# Altium schematic sheet STM32H743_Breakout_V2_TOP.SchDoc
size A4; SheetNumber: 1; SheetTotal: 3
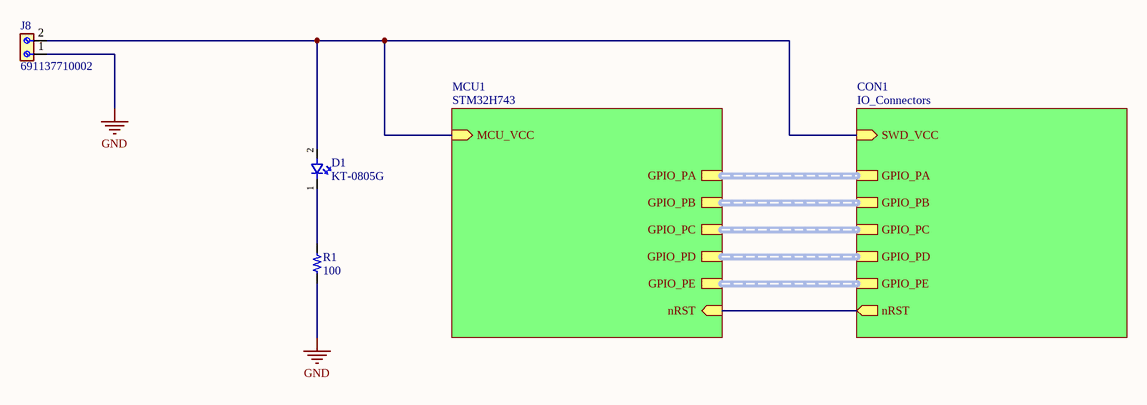
[diagram p0: STM32H743_Breakout_V2_TOP.SchDoc]

## Parts
D1  KT-0805G  [HubeiKENTO_0805]
J8  691137710002  [691137710002]
R1  Resistance: 100  [R-0603]  (hidden comment: R 0603 100 1% 0.100W 200PPM)

## Sub-sheets
CON1 = IO_Connectors: SWD_VCC (in), GPIO_PE (harness 16_GPIO), GPIO_PD (harness 16_GPIO), GPIO_PC (harness 16_GPIO), GPIO_PB (harness 16_GPIO), GPIO_PA (harness STM32H7_PA), nRST (out)
MCU1 = STM32H743: MCU_VCC (in), GPIO_PA (harness STM32H7_PA), GPIO_PB (harness 16_GPIO), GPIO_PC (harness 16_GPIO), GPIO_PD (harness 16_GPIO), GPIO_PE (harness 16_GPIO), nRST (in)

## Nets
GND: J8.1 R1.1
NetD1_1: D1.1 R1.2
NetD1_2: D1.2 J8.2 ; sheet MCU1/MCU_VCC, sheet CON1/SWD_VCC
(unnamed): sheet MCU1/nRST, sheet CON1/nRST

## Buses and harness runs
harness sheet CON1/GPIO_PA = sheet MCU1/GPIO_PA
harness sheet CON1/GPIO_PB = sheet MCU1/GPIO_PB
harness sheet CON1/GPIO_PC = sheet MCU1/GPIO_PC
harness sheet CON1/GPIO_PD = sheet MCU1/GPIO_PD
harness sheet CON1/GPIO_PE = sheet MCU1/GPIO_PE

## Library data of the parts
D1 = CMP-00081-2: Green 520nm LED 2.8V 0805; Lens Color: Colorless; Luminous Intensity: 230mcd; Maximum Forward Current: 20mA; Case/Package: 0805; Min Operating Temperature: -40°C; Forward Voltage: 2.8V; Wavelength: 520nm; LCSC P/N: C2297; Color: Green; Max Operating Temperature: 85°C; Digikey P/N: 846-SMLMN2ECTT86CCT-ND; Test Current: 20mA
J8 = CMP-009-000000-2: 2 Position Wire to Board Terminal Block Horizontal with Board 0.197 (5.00mm) Through Hole; MF: Wurth Electronics; Availability: In Stock; MP: 691137710002; Source: 691137710002.SchLib; Package: None; Pin Count: 2; Component Type: Standard; SnapEDA_Link: https://www.snapeda.com/parts/691137710002/Wurth+Electronics+Inc./view-part/?ref=snap; Check_prices: https://www.snapeda.com/parts/691137710002/Wurth+Electronics+Inc./view-part/?ref=eda; Price: None; Value: *; Design Item ID: 691137710002
R1 = CMP-00095-2: SMD Resistor, Thick Film; Power Rating: 100mW; Voltage Rating: 75V; Tolerance: 1%; Case/Package: 0603; Temperature Coefficient: 200ppm; Max Operating Temperature: 155°C; LCSC P/N: C22775; RoHS: Yes; Composition: Thick Film; Min Operating Temperature: -55°C